# Altium schematic sheet Controller_power.SchDoc
size A4
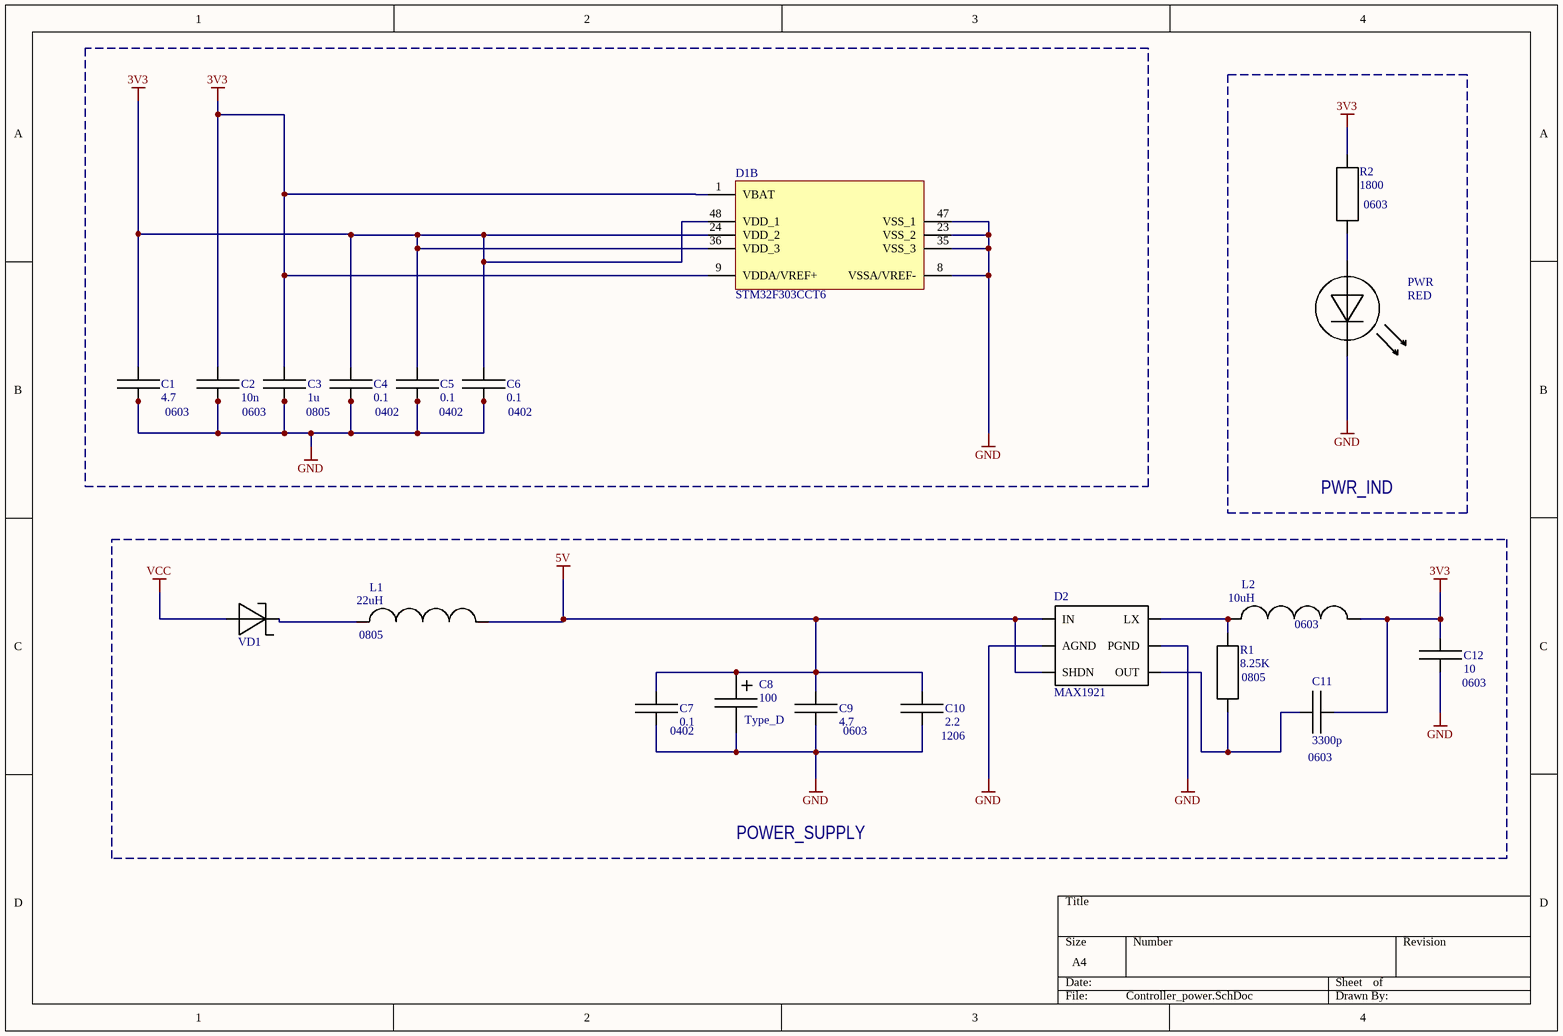
[diagram p0: Controller_power.SchDoc]

## Parts
C1  4.7  [SMD_0603_C]
C2  10n  [SMD_0603_C]
C3  1u  [SMD_0805]
C4  0.1  [SMD_0402_C]
C5  0.1  [SMD_0402_C]
C6  0.1  [SMD_0402_C]
C7  0.1  [SMD_0402_C]
C8  100  [SMD_7343]
C9  4.7  [SMD_0603_C]
C10  2.2  [SMD_1206]
C11  3300p  [SMD_0603_C]
C12  10  [SMD_0603_C]
D1  STM32F303CCT6  [STM-LQFP48_N]  (part B of 2)
D2  MAX1921  [SOT23(95P280X145-6N)]
L1  22uH  [SMD_0805]
L2  10uH  [SMD_0603]
PWR  RED  [SMD_LED]
R1  8.25K  [SMD_0805]
R2  1800  [SMD_0603]
VD1  Diode_schottky  [SOD_123]  (value not drawn)

## Blocks framed on the sheet
PWR_IND: PWR R2
POWER_SUPPLY: C7-C12 D2 L1 L2 R1 VD1

## Nets
3V3: C1.2 C2.2 C3.2 C4.2 C5.2 C6.2 C11.2 C12.2 D1.1(VBAT) D1.9(VDDA/VREF+) D1.24(VDD_2) D1.36(VDD_3) D1.48(VDD_1) L2.2 R2.2
5V: C7.2 C8.1 C9.2 C10.2 D2.1(IN) D2.3(SHDN) L1.2
GND: C1.1 C2.1 C3.1 C4.1 C5.1 C6.1 C7.1 C8.2 C9.1 C10.1 C12.1 D1.8(VSSA/VREF-) D1.23(VSS_2) D1.35(VSS_3) D1.47(VSS_1) D2.2(AGND) D2.5(PGND) PWR.1
VCC: VD1.1
NetC11_1: C11.1 D2.4(OUT) R1.1
NetD2_6: D2.6(LX) L2.1 R1.2
NetL1_1: L1.1 VD1.2
NetPWR_2: PWR.2 R2.1

## Notes on the sheet
- (near R2) 0603
- 0603
- 0805
- 0402
- (near C6) 0402
- (near L1) 0805
- (near L2) 0603
- (near R1) 0805
- (near C12) 0603
- (near C7) 0402
- (near C8) Type_D
- (near C9) 0603
- (near C10) 1206
- (near C11) 0603

## Library data of the parts
C1-C7 C9-C12 = Capacitor
C8 = Capacitor polar
D1 = STM32F303CCT6: ARM Cortex-M4 32-bit MCU, 256 KB Flash, 40 KB Internal RAM, 37 I/Os, 48-pin LQFP, -40 to 85 degC, Tray; D/A Converter: 2x12-bit (2 Channel); FLASH Size (Prog) (kB): 256; I/Os (High Current): 37; Internal RAM Size (kB): 40; Operating Frequency(F) (Processor speed) (MHz): 72; Supply Voltage(Vcc) min (V): 2; DatasheetVersion: Rev. 6; PackageVersion: Rev. 6, 06/2013; PackageReference: LQFP48; PackageDescription: 48-Pin Low Profile Quad Flat Package, 7 x 7 mm Body, 0.5 mm Pitch; Supplier 1: Digi-Key; Supplier Part Number 1: 497-13318-ND; Supplier 2: Newark; Supplier Part Number 2: 46W2192; Supplier 3: Newark; Supplier Part Number 3: 66W7286; Supplier 4: Mouser; Supplier Part Number 4: 511-STM32F303CCT6; Core: ARM Cortex-M4; Packing: Tray; Mounting Technology: Surface Mount; PartNumber: STM32F303CCT6; ComponentLink1Description: Manufacturer URL; ComponentLink1URL: http://www.st.com/web/en/home.html; ComponentLink2Description: Datasheet; ComponentLink2URL: http://www.st.com/st-web-ui/static/active/en/resource/technical/document/datasheet/DM00058181.pdf; ComponentLink3Description: Package Specification; ComponentLink3URL: http://www.st.com/st-web-ui/static/active/en/resource/technical/document/datasheet/DM00058181.pdf
L1 L2 = Inductor
PWR = LED_Diode
R1 = Resistor
R2 = Resistor: 0603 resistor